# EasyEDA Pro project Hardware.epro, schematic Schematic1
Board Name: Board1; Create Date: 2025-01-02; Page Name: P1; Project Name: Taiwan; Schematic Name: Schematic1; Update Date: 2025-01-04; Company: EasyEDA.com; Page Size: A4; Version: V1.0
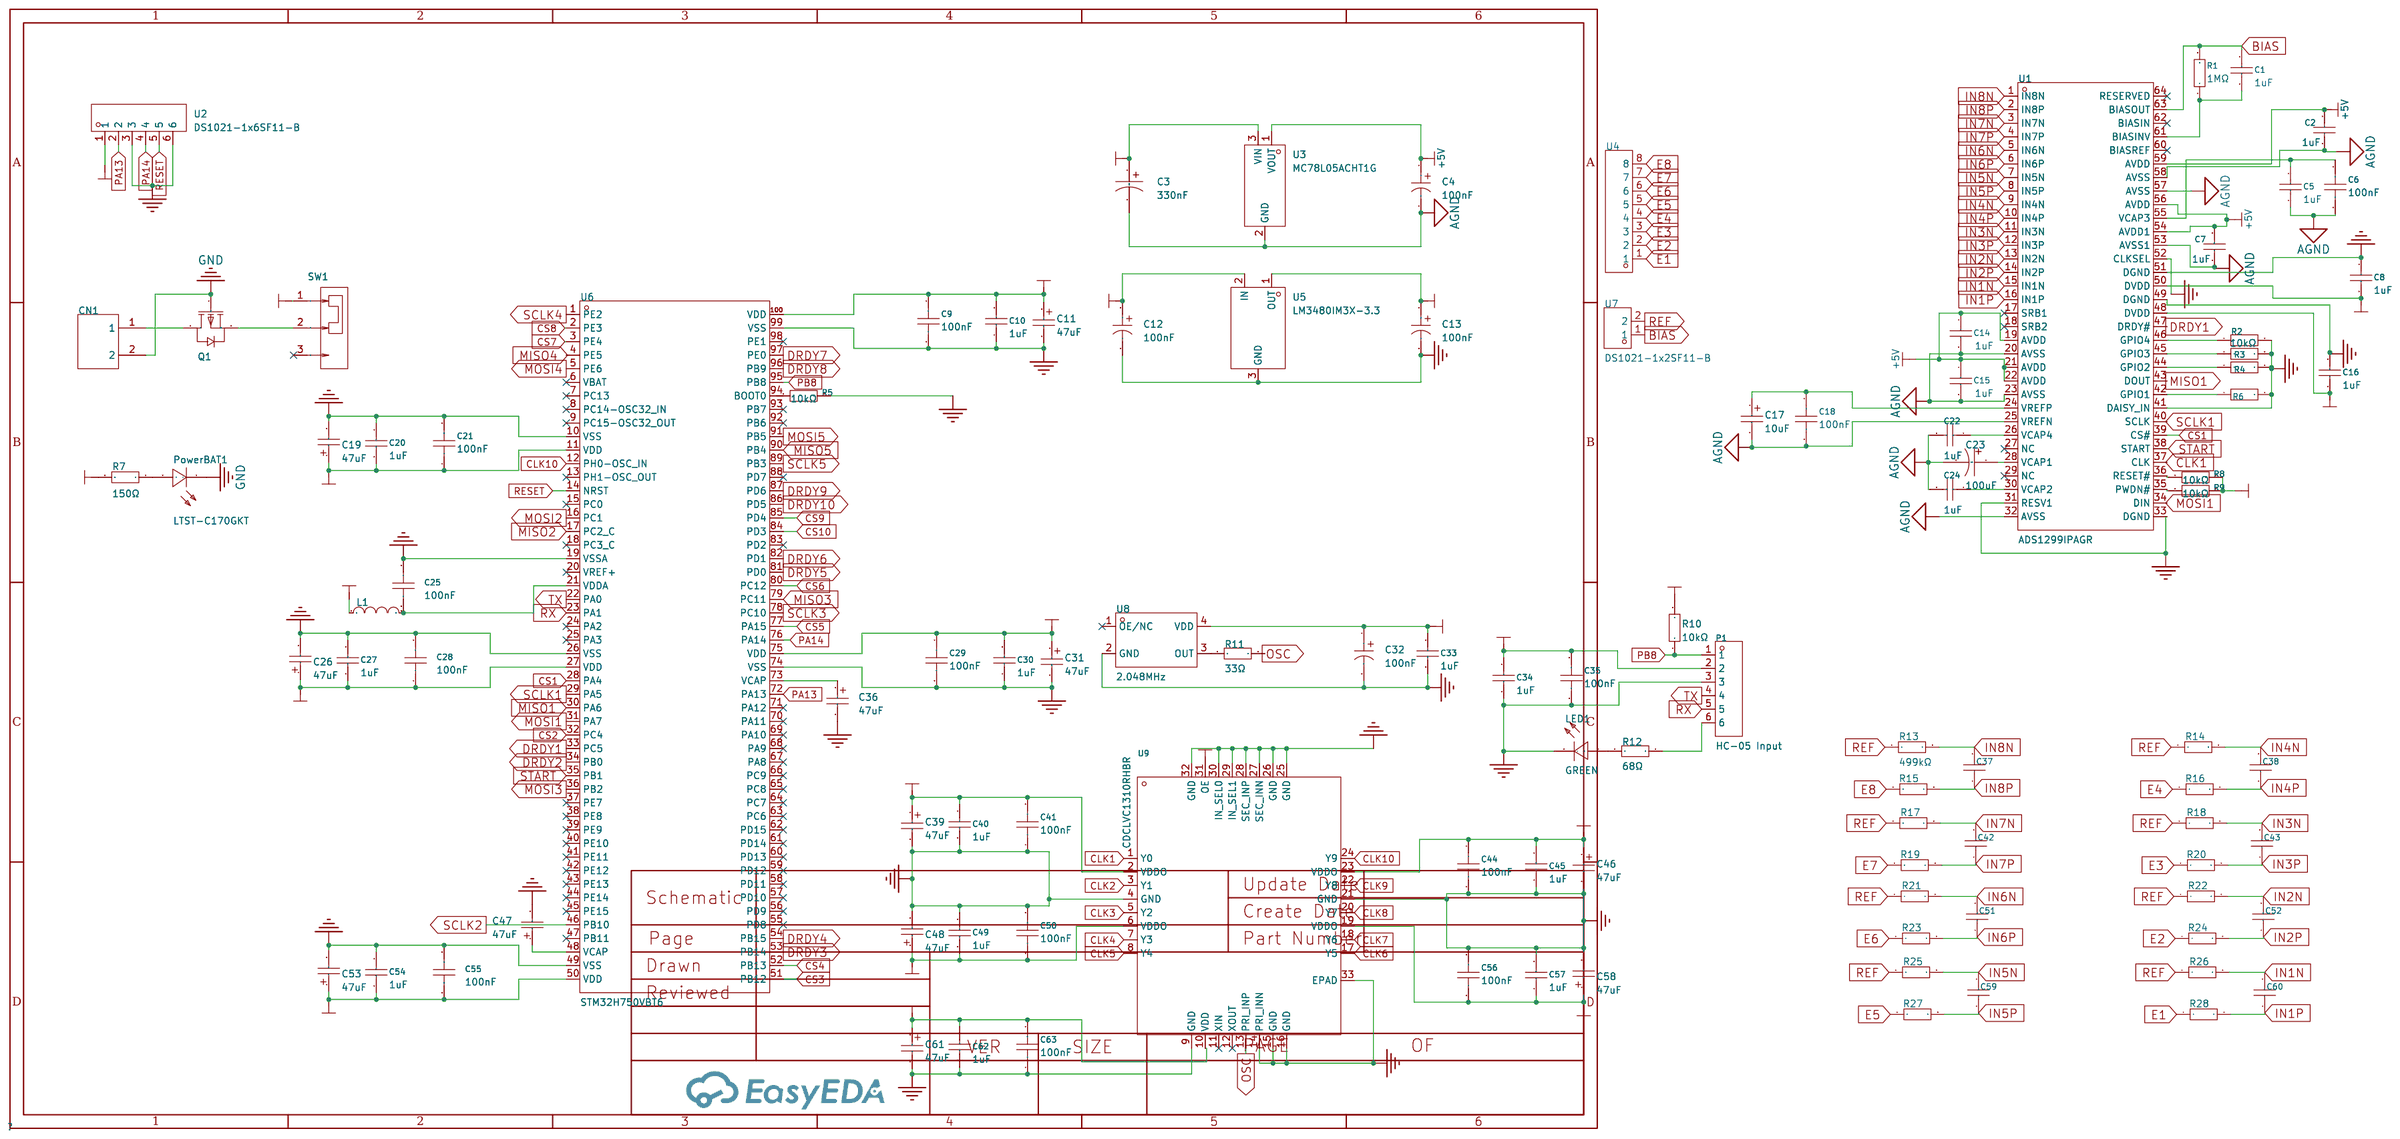
[diagram p0: schematic sheet]

## Parts
C1  1uF  [C0402]
C2  1uF  [C0402]
C3  330nF  [CAP-SMD_L3.2-W1.6]
C4  100nF  [CAP-SMD_L3.2-W1.6-RD]
C5  1uF  [C0402]
C6  100nF  [C0603]
C7  1uF  [C0402]
C8  1uF  [C0402]
C9  100nF  [C0603]
C10  1uF  [C0402]
C11  47uF  [CAP-SMD_L3.5-W2.8-R-RD]
C12  100nF  [CAP-SMD_L3.2-W1.6-RD]
C13  100nF  [CAP-SMD_L3.2-W1.6-RD]
C14  1uF  [C0402]
C15  1uF  [C0402]
C16  1uF  [C0402]
C17  10uF  [CASE-A_3216]
C18  100nF  [C0603]
C19  47uF  [CAP-SMD_L3.5-W2.8-R-RD]
C20  1uF  [C0402]
C21  100nF  [C0603]
C22  1uF  [C0402]
C23  100uF  [CAP-SMD_BD8.0-L8.3-W8.3-FD]
C24  1uF  [C0402]
C25  100nF  [C0603]
C26  47uF  [CAP-SMD_L3.5-W2.8-R-RD]
C27  1uF  [C0402]
C28  100nF  [C0603]
C29  100nF  [C0603]
C30  1uF  [C0402]
C31  47uF  [CAP-SMD_L3.5-W2.8-R-RD]
C32  100nF  [CAP-SMD_L3.2-W1.6-RD]
C33  1uF  [C0402]
C34  1uF  [C0402]
C35  100nF  [C0603]
C36  47uF  [CAP-SMD_L3.5-W2.8-R-RD]
C37  2.2nF  [C0603]
C38  2.2nF  [C0603]
C39  47uF  [CAP-SMD_L3.5-W2.8-R-RD]
C40  1uF  [C0402]
C41  100nF  [C0603]
C42  2.2nF  [C0603]
C43  2.2nF  [C0603]
C44  100nF  [C0603]
C45  1uF  [C0402]
C46  47uF  [CAP-SMD_L3.5-W2.8-R-RD]
C47  47uF  [CAP-SMD_L3.5-W2.8-R-RD]
C48  47uF  [CAP-SMD_L3.5-W2.8-R-RD]
C49  1uF  [C0402]
C50  100nF  [C0603]
C51  2.2nF  [C0603]
C52  2.2nF  [C0603]
C53  47uF  [CAP-SMD_L3.5-W2.8-R-RD]
C54  1uF  [C0402]
C55  100nF  [C0603]
C56  100nF  [C0603]
C57  1uF  [C0402]
C58  47uF  [CAP-SMD_L3.5-W2.8-R-RD]
C59  2.2nF  [C0603]
C60  2.2nF  [C0603]
C61  47uF  [CAP-SMD_L3.5-W2.8-R-RD]
C62  1uF  [C0402]
C63  100nF  [C0603]
CN1  B2B-PH-K-S(LF)(SN)  [CONN-TH_B2B-PH-K-S]
L1  BLM18KG601SN1D  [L0603]
LED1  GREEN  [LED0805-RD_GREEN]
P1  HC-05 Input  [HDR-TH_6P-P2.54-V-F]
PowerBAT1  LTST-C170GKT  [LED0805-RD_GREEN]
Q1  FQP47P06  [TO-220F-3_L10.2-W4.9-P2.54-L]
R1  1MΩ  [R0402]
R2  10kΩ  [R0402]
R3  10kΩ  [R0402]
R4  10kΩ  [R0402]
R5  10kΩ  [R0805]
R6  10kΩ  [R0402]
R7  150Ω  [R0402]
R8  10kΩ  [R0805]
R9  10kΩ  [R0805]
R10  10kΩ  [R0603]
R11  33Ω  [R0402]
R12  68Ω  [R0603]
R13  499kΩ  [R0603]
R14  499kΩ  [R0603]
R15  499kΩ  [R0603]
R16  499kΩ  [R0603]
R17  499kΩ  [R0603]
R18  499kΩ  [R0603]
R19  499kΩ  [R0603]
R20  499kΩ  [R0603]
R21  499kΩ  [R0603]
R22  499kΩ  [R0603]
R23  499kΩ  [R0603]
R24  499kΩ  [R0603]
R25  499kΩ  [R0603]
R26  499kΩ  [R0603]
R27  499kΩ  [R0603]
R28  499kΩ  [R0603]
SW1  SS-12D10-G050  [SW-TH_SS-12D10-G050]
U1  ADS1299IPAGR  [TQFP-64_L10.0-W10.0-P0.50-LS12.0-TL]
U2  DS1021-1x6SF11-B  [CONN-TH_DS1021-1X6SF11-B]
U3  MC78L05ACHT1G  [SOT-89-3_L4.5-W2.5-P1.50-LS4.2-BR]
U4  HB-PH3-25418PB2GOP  [HDR-TH_8P-P2.54-V-M]
U5  LM3480IM3X-3.3  [SOT-23-3_L2.9-W1.3-P1.90-LS2.4-BR]
U6  STM32H750VBT6  [LQFP-100_L14.0-W14.0-P0.50-LS16.0-BL]
U7  DS1021-1x2SF11-B  [HDR-TH_2P-P2.54-V-M]
U8  2.048MHz  [OSC-SMD_4P-L3.2-W2.5-BL-1]
U9  CDCLVC1310RHBR  [QFN-32_L5.0-W5.0-P0.50-TL-EP3.4]

## Library data of the parts
C1 C2 C5 C7 C8 C10 C14-C16 C20 C22 C24 C27 C30 C33 C34 C40 C45 C49 C54 C57 C62 = CL05A105KO5NNNC: Capacitance: Tolerance:±10% Tolerance:±10% Voltage Rated: Temperature Coefficient:; LCSC Part Name: 1uF ±10% 16V; Supplier Part: C29266; Manufacturer: SAMSUNG(三星); Supplier Footprint: 0402; Datasheet: https://atta.szlcsc.com/upload/public/pdf/source/20160218/1457707763339.pdf; Supplier: LCSC; Tolerance: ±10%
C3 = CA45A-A-35V-0.33UF-K: Capacitance:330nF Tolerance:±10% Tolerance:±10% Rated Voltage: Operating Temperature:-55℃~+125℃ Operating Temperature:-55℃~+125℃; LCSC Part Name: 330nF ±10% 35V; Supplier Part: C2976917; Manufacturer: CEC(振华新云); Supplier Footprint: SMD,1.6x3.2mm; JLCPCB Part Class: Extended Part; Datasheet: https://atta.szlcsc.com/upload/public/pdf/source/20220222/C2C5F368BEBB90E653B4407F98E5644A.pdf; Supplier: LCSC; Tolerance: ±10%; Operating Temperature: -55℃~+125℃
C4 C12 C13 C32 = CA45A-A-35V-0.1UF-K: Capacitance:100nF Tolerance:±10% Tolerance:±10% Rated Voltage: Operating Temperature:-55℃~+125℃ Operating Temperature:-55℃~+125℃; LCSC Part Name: 100nF ±10% 35V; Supplier Part: C2976899; Manufacturer: CEC(振华新云); Supplier Footprint: SMD,1.6x3.2mm; JLCPCB Part Class: Extended Part; Datasheet: https://atta.szlcsc.com/upload/public/pdf/source/20220222/C2C5F368BEBB90E653B4407F98E5644A.pdf; Supplier: LCSC; Tolerance: ±10%; Operating Temperature: -55℃~+125℃
C6 C9 C18 C21 C25 C28 C29 C35 C41 C44 C50 C55 C56 C63 = CC0603KRX7R9BB104: Capacitance: Tolerance:±10% Tolerance:±10% Voltage Rated: Temperature Coefficient:; LCSC Part Name: 100nF ±10% 50V; Supplier Part: C14663; Manufacturer: YAGEO(国巨); Supplier Footprint: 0603; JLCPCB Part Class: Basic Part; Datasheet: https://atta.szlcsc.com/upload/public/pdf/source/20180910/C282072_33301C7F631E79921B82A8DAC6BCC5B3.pdf; Supplier: LCSC; Tolerance: ±10%
C11 C19 C26 C31 C36 C39 C46-C48 C53 C58 C61 = CA45-B010K476T: Capacitance: Tolerance:±10% Tolerance:±10% Rated Voltage: Equivalent Series Resistance(ESR):1Ω@100kHz Operating Temperature:-55℃~+125℃ Operating Temperature:-55℃~+125℃; LCSC Part Name: 47uF ±10% 10V; Supplier Part: C123253; Manufacturer: 湘怡中元/湘江; Supplier Footprint: CASE-B-3528; JLCPCB Part Class: Extended Part; Datasheet: https://atta.szlcsc.com/upload/public/pdf/source/20191009/C435293_78A410F3D73489DBEAC46056C4262F7A.pdf; Supplier: LCSC; Tolerance: ±10%; Equivalent Series Resistance(ESR): 1Ω@100kHz; Operating Temperature: -55℃~+125℃
C17 = T491A106K016AT: Capacitance: Tolerance:±10% Tolerance:±10% Rated Voltage: Equivalent Series Resistance(ESR):3Ω@100kHz Operating Temperature:-55℃~+125℃ Operating Temperature:-55℃~+125℃; LCSC Part Name: 10uF ±10% 16V; Supplier Part: C110055; Manufacturer: KEMET(基美); Supplier Footprint: CASE-A-3216-18(mm); JLCPCB Part Class: Extended Part; Datasheet: https://atta.szlcsc.com/upload/public/pdf/source/20190402/C118128_17DC26F5D7668F0165447CB640F1E367.pdf; Supplier: LCSC; Tolerance: ±10%; Equivalent Series Resistance(ESR): 3Ω@100kHz; Operating Temperature: -55℃~+125℃
C23 = CK1H101M-CRF10: Capacitance: Tolerance:±20% Tolerance:±20% Rated Voltage: Ripple Current:- Equivalent Series Resistance(ESR):- φD: L: Lifetime @ Temp:2000hrs@105℃ Operating Temperature:-40℃~+105℃ Operating Temperature:-40℃~+105℃; LCSC Part Name: 100uF ±20% 50V; Supplier Part: C129420; Manufacturer: ST(先科); Supplier Footprint: SMD,D8xL10.5mm; Datasheet: https://atta.szlcsc.com/upload/public/pdf/source/20180511/C191812_AFB6060B7C8A92684C0DBB73273612B6.pdf; Supplier: LCSC; Tolerance: ±20%; Lifetime @ Temp: 2000hrs@105℃; Operating Temperature: -40℃~+105℃
C37 C38 C42 C43 C51 C52 C59 C60 = CC0603JRNPO9BN222: Capacitance: Tolerance:±5% Tolerance:±5% Voltage Rated: Temperature Coefficient:; LCSC Part Name: 2.2nF ±5% 50V; Supplier Part: C107043; Manufacturer: YAGEO(国巨); Supplier Footprint: 0603; JLCPCB Part Class: Extended Part; Datasheet: https://atta.szlcsc.com/upload/public/pdf/source/20170914/C128857_1505359892143968080.pdf; Supplier: LCSC; Tolerance: ±5%
CN1 = B2B-PH-K-S(LF)(SN): Pins Structure:1x2P Pitch:2mm Mounting Style:Direct Insert Reference Series:PH Number of Pins:2P Number of Rows:1 Number of PINs Per Row:2 Row Spacing:- Current Rating (Max):2A Contact Material:Brass Contact Plating:Tin Operating Temperature Range:-25℃~+8; LCSC Part Name: 1x2P 间距:2mm 直插 系列:PH; Supplier Part: C131337; Manufacturer: JST; Supplier Footprint: 插件,P=2mm; JLCPCB Part Class: Extended Part; Datasheet: https://atta.szlcsc.com/upload/public/pdf/source/20171026/C131342_15089839687311058815.pdf; Supplier: LCSC; Pins Structure: 1x2P; Pitch: 2mm; Mounting Style: Direct Insert; Reference Series: PH; Number of Pins: 2P; Number of Rows: 1; Number of PINs Per Row: 2; Current Rating (Max): 2A; Contact Material: Brass; Contact Plating: Tin; Operating Temperature Range: -25℃~+85℃; Rated Voltage (Max): 100V; Plastic Material: PA66; Flame Retardant Rating: UL94V-0; Supplementary Features: K-leg punch; Colour: White; Z-Height of the Board: 6mm; X-Length of Bottom Edge on Board (Spacing Line): 5.9mm; Y-Width of Bottom Edge on Board: 4.5mm
L1 = BLM18KG601SN1D: Impedance @ Frequency:600Ω@100MHz Tolerance:±25% Tolerance:±25% DC Resistance:150mΩ Current Rating:1.3A Circuits:1; LCSC Part Name: 单路 0603磁珠 阻抗600Ω@100MHz; Supplier Part: C85833; Manufacturer: muRata(村田); Supplier Footprint: 0603; JLCPCB Part Class: Extended Part; Datasheet: https://atta.szlcsc.com/upload/public/pdf/source/20180329/C160981_FD3C2D2622A377E203B89F4AA32B0741.pdf; Supplier: LCSC; Impedance @ Frequency: 600Ω@100MHz; Tolerance: ±25%; DC Resistance: 150mΩ; Current Rating: 1.3A; Circuits: 1
LED1 PowerBAT1 = LTST-C170GKT: Emitted Color:Green-yellow Forward Voltage (VF):2.1V Forward Voltage (VF):2.1V Power Dissipation:100mW Forward Current:20mA Dominant Wavelength:569nm Dominant Wavelength:569nm Peak Wavelength:565nm Diode Configuration:- Lens Color:无色透明透镜 Color Temperature; LCSC Part Name: 普绿/黄绿; Supplier Part: C125090; Manufacturer: LITEON(光宝); Supplier Footprint: 0805; JLCPCB Part Class: Extended Part; Datasheet: https://atta.szlcsc.com/upload/public/pdf/source/20180326/C125090_EBB69FE12E2FDEBBD69344A68ADD0880.pdf; Supplier: LCSC; Emitted Color: Green-yellow; Forward Voltage (VF): 2.1V; Power Dissipation: 100mW; Forward Current: 20mA; Dominant Wavelength: 569nm; Peak Wavelength: 565nm; Lens Color: 无色透明透镜; Luminous Intensity: 6mcd; Viewing Angle: 130°; Operating Temperature: -55℃~+85℃
P1 = 2.54-1*6P母: Holes Structure:1x6P Pitch:2.54mm Row Spacing:- Mounting Type:Straight Number of Rows:Plugin Number of Holes:6P Insulation Height:- Contact Material:- Contact Plating:-; LCSC Part Name: 间距:2.54mm 1x6P 直插; Supplier Part: C40877; Manufacturer: BOOMELE(博穆精密); Supplier Footprint: 插件,P=2.54mm; Datasheet: https://atta.szlcsc.com/upload/public/pdf/source/20210301/C2718488_F4427B881E42CAA8DDB0B1C12B3A522C.pdf; Supplier: LCSC; Holes Structure: 1x6P; Pitch: 2.54mm; Mounting Type: Straight; Number of Rows: Plugin; Number of Holes: 6P
Q1 = FQP47P06: Type:1个PChannel Drain Source Voltage (Vdss): Continuous Drain Current (Id): Power Dissipation (Pd): Drain Source On Resistance (RDS(on)@Vgs,Id):26mΩ@10V,23.5A Gate Threshold Voltage (Vgs(th)@Id): Total Gate Charge (Qg@Vgs):110nC@10V Input Capacitance (Cis; LCSC Part Name: 1个P沟道 耐压:60V 电流:47A; Supplier Part: C462765; Manufacturer: onsemi(安森美); Supplier Footprint: TO-220F-3; Datasheet: https://atta.szlcsc.com/upload/public/pdf/source/20221020/0214B1BC3D3CD69C1E14A9085F94831E.pdf; Supplier: LCSC; Type: 1个PChannel; Drain Source On Resistance (RDS(on)@Vgs,Id): 26mΩ@10V,23.5A; Total Gate Charge (Qg@Vgs): 110nC@10V; Input Capacitance (Ciss@Vds): 3.6nF@25V; Operating Temperature: -55℃~+175℃@(Tj)
R1 = 0402WGF1004TCE: Type:Thick Film Resistors Resistance:1MΩ Tolerance:±1% Tolerance:±1% Power(Watts): Overload Voltage (Max): Temperature Coefficient:±100ppm/℃ Temperature Coefficient:±100ppm/℃ Operating Temperature Range:-55℃~+155℃ Operating Temperature Range:-55℃~+155℃; LCSC Part Name: 1MΩ ±1% 62.5mW 厚膜电阻; Supplier Part: C26083; Manufacturer: UNI-ROYAL(厚声); Supplier Footprint: 0402; JLCPCB Part Class: Basic Part; Datasheet: https://atta.szlcsc.com/upload/public/pdf/source/20200306/C422600_1E6D84923E4A46A82E41ADD87F860B5C.pdf; Supplier: LCSC; Type: Thick Film Resistors; Tolerance: ±1%; Temperature Coefficient: ±100ppm/℃; Operating Temperature Range: -55℃~+155℃
R2-R4 R6 = TR0402D10K0Q1025Z: Type:Thin Film Resistor Resistance: Tolerance:±0.5% Tolerance:±0.5% Power(Watts): Overload Voltage (Max): Temperature Coefficient:±25ppm/℃ Temperature Coefficient:±25ppm/℃ Operating Temperature Range:-55℃~+155℃ Operating Temperature Range:-55℃~+155℃; LCSC Part Name: 薄膜电阻 10kΩ ±0.5% 63mW; Supplier Part: C149898; Manufacturer: EVER OHMS(天二科技); Supplier Footprint: 0402; Datasheet: https://atta.szlcsc.com/upload/public/pdf/source/20190527/C149900_32B1354086E9F6A772108AB7B2B7A514.pdf; Supplier: LCSC; Type: Thin Film Resistor; Tolerance: ±0.5%; Temperature Coefficient: ±25ppm/℃; Operating Temperature Range: -55℃~+155℃
R5 R8 R9 = QR0805J10K0P05Z: Type:Thick Film Resistors Resistance: Tolerance:±5% Tolerance:±5% Power(Watts): Overload Voltage (Max): Temperature Coefficient:±100ppm/℃ Temperature Coefficient:±100ppm/℃ Operating Temperature Range:-55℃~+155℃ Operating Temperature Range:-55℃~+155℃; LCSC Part Name: 厚膜电阻 10kΩ ±5% 125mW; Supplier Part: C149881; Manufacturer: EVER OHMS(天二科技); Supplier Footprint: 0805; JLCPCB Part Class: Extended Part; Datasheet: https://atta.szlcsc.com/upload/public/pdf/source/20190816/C191725_FB5BDDD87CE7DE7F0F741FE894220CBC.pdf; Supplier: LCSC; Type: Thick Film Resistors; Tolerance: ±5%; Temperature Coefficient: ±100ppm/℃; Operating Temperature Range: -55℃~+155℃
R7 = 0402WGF1500TCE: Type:Thick Film Resistors Resistance: Tolerance:±1% Tolerance:±1% Power(Watts): Overload Voltage (Max): Temperature Coefficient:±100ppm/℃ Temperature Coefficient:±100ppm/℃ Operating Temperature Range:-55℃~+155℃ Operating Temperature Range:-55℃~+155℃; LCSC Part Name: 150Ω ±1% 62.5mW 厚膜电阻; Supplier Part: C25082; Manufacturer: UNI-ROYAL(厚声); Supplier Footprint: 0402; JLCPCB Part Class: Extended Part; Datasheet: https://atta.szlcsc.com/upload/public/pdf/source/20200306/C422600_1E6D84923E4A46A82E41ADD87F860B5C.pdf; Supplier: LCSC; Type: Thick Film Resistors; Tolerance: ±1%; Temperature Coefficient: ±100ppm/℃; Operating Temperature Range: -55℃~+155℃
R10 = CR-03FA7---10K: Type:Thick Film Resistors Resistance: Tolerance:±1% Tolerance:±1% Power(Watts): Overload Voltage (Max): Operating Temperature Range:-55℃~+155℃ Operating Temperature Range:-55℃~+155℃; LCSC Part Name: 厚膜电阻 10kΩ ±1% 100mW; Supplier Part: C285206; Manufacturer: Viking(光颉); Supplier Footprint: 0603; JLCPCB Part Class: Extended Part; Datasheet: https://atta.szlcsc.com/upload/public/pdf/source/20200107/C465489_CF6A3EB1EF1274672E8D2C2ED68CFF51.pdf; Supplier: LCSC; Type: Thick Film Resistors; Tolerance: ±1%; Operating Temperature Range: -55℃~+155℃
R11 = RTT02330JTH: Type:Thick Film Resistors Resistance: Tolerance:±5% Tolerance:±5% Power(Watts): Overload Voltage (Max): Temperature Coefficient:±100ppm/℃ Temperature Coefficient:±100ppm/℃ Operating Temperature Range:-55℃~+155℃ Operating Temperature Range:-55℃~+155℃; LCSC Part Name: 厚膜电阻 33Ω ±5% 62.5mW; Supplier Part: C102978; Manufacturer: RALEC(旺诠); Supplier Footprint: 0402; Datasheet: https://atta.szlcsc.com/upload/public/pdf/source/20191219/C158410_884373A5B7E1BC76BF57BC45A946C093.pdf; Supplier: LCSC; Type: Thick Film Resistors; Tolerance: ±5%; Temperature Coefficient: ±100ppm/℃; Operating Temperature Range: -55℃~+155℃
R12 = RC0603FR-0768RL: Type:Thick Film Resistors Resistance: Tolerance:±1% Tolerance:±1% Power(Watts): Overload Voltage (Max): Temperature Coefficient:±100ppm/℃ Temperature Coefficient:±100ppm/℃ Operating Temperature Range:-55℃~+155℃ Operating Temperature Range:-55℃~+155℃; LCSC Part Name: 厚膜电阻 68Ω ±1% 100mW; Supplier Part: C126362; Manufacturer: YAGEO(国巨); Supplier Footprint: 0603; JLCPCB Part Class: Extended Part; Datasheet: https://atta.szlcsc.com/upload/public/pdf/source/20180821/C275644_0D56F95EFF785E7D9A1FEF436B37DA78.pdf; Supplier: LCSC; Type: Thick Film Resistors; Tolerance: ±1%; Temperature Coefficient: ±100ppm/℃; Operating Temperature Range: -55℃~+155℃
R13-R28 = RC0603FR-07499KL: Type:Thick Film Resistors Resistance: Tolerance:±1% Tolerance:±1% Power(Watts): Overload Voltage (Max): Temperature Coefficient:±100ppm/℃ Temperature Coefficient:±100ppm/℃ Operating Temperature Range:-55℃~+155℃ Operating Temperature Range:-55℃~+155℃; LCSC Part Name: 厚膜电阻 499kΩ ±1% 100mW; Supplier Part: C131054; Manufacturer: YAGEO(国巨); Supplier Footprint: 0603; JLCPCB Part Class: Extended Part; Datasheet: https://atta.szlcsc.com/upload/public/pdf/source/20180821/C275644_0D56F95EFF785E7D9A1FEF436B37DA78.pdf; Supplier: LCSC; Type: Thick Film Resistors; Tolerance: ±1%; Temperature Coefficient: ±100ppm/℃; Operating Temperature Range: -55℃~+155℃
SW1 = SS-12D10-G050: Circuit:SPDT Actuator Style:Rectangular columnar Pin Style:PCPin Switch Length:12.7mm Switch Width:6.8mm Switch Height:11.4mm Mounting Style:Straight Actuator Color:Black Current Rating (DC):3A Voltage Rating (DC):24V Current Rating (AC):- Voltage Rating; LCSC Part Name: 柄长5mm 直插两档 滑动开关; Supplier Part: C2848933; Manufacturer: G-Switch(品赞); Supplier Footprint: 插件; JLCPCB Part Class: Extended Part; Datasheet: https://atta.szlcsc.com/upload/public/pdf/source/20220706/9966F8B8B46280D285B978EDB9B49EE5.pdf; Supplier: LCSC; Circuit: SPDT; Actuator Style: Rectangular columnar; Pin Style: PCPin; Switch Length: 12.7mm; Switch Width: 6.8mm; Switch Height: 11.4mm; Mounting Style: Straight; Actuator Color: Black; Current Rating (DC): 3A; Voltage Rating (DC): 24V; Mechanical Life: 1万次; Operating Temperature: -25℃~+70℃
U1 = ADS1299IPAGR: Supply Voltage:5V；1.8V~3.6V Supply Voltage:5V；1.8V~3.6V; LCSC Part Name: ADS1299-x 低噪声、4/6/8通道、24bit 、同时采样模数转换器，用于EEG和生物电bit 测量; Supplier Part: C476817; Manufacturer: TI(德州仪器); Supplier Footprint: TQFP-64(10x10); JLCPCB Part Class: Extended Part; Datasheet: https://www.ti.com/cn/lit/gpn/ads1299; Supplier: LCSC; Supply Voltage: 5V；1.8V~3.6V
U2 = DS1021-1x6SF11-B: Pin Structure:1x6P Pitch:2.54mm Mounting Type:Direct Insert Number of Rows:Single Row Number of Pins:6P; LCSC Part Name: 1x6P 间距:2.54mm 直插; Supplier Part: C7430362; Manufacturer: CONNFLY; Supplier Footprint: 插件,P=2.54mm; JLCPCB Part Class: Extended Part; Datasheet: https://atta.szlcsc.com/upload/public/pdf/source/20230721/045F128FE19DC325F71FA0C1C07679E3.pdf; Supplier: LCSC; Pin Structure: 1x6P; Pitch: 2.54mm; Mounting Type: Direct Insert; Number of Rows: Single Row; Number of Pins: 6P
U3 = MC78L05ACHT1G: Output Type:Fixed Maximum Input Voltage:30V Output Voltage:5V Output Voltage:5V Output Current:100mA Power Supply Rejection Ratio (PSRR):49dB@(120Hz) standby current:6mA Feature:ESD Protection；Short-Circuit  Protection；Thermal Protection(TSD)；Under-voltag; Supplier Part: C904222; Manufacturer: onsemi(安森美); Supplier Footprint: SOT-89-3; Datasheet: https://atta.szlcsc.com/upload/public/pdf/source/20210719/C903152_B90E42F1E3F8E53767481E91112C0A3A.pdf; Supplier: LCSC; Output Type: Fixed; Maximum Input Voltage: 30V; Output Voltage: 5V; Output Current: 100mA; Power Supply Rejection Ratio (PSRR): 49dB@(120Hz); standby current: 6mA; Feature: ESD Protection；Short-Circuit  Protection；Thermal Protection(TSD)；Under-voltage Lockout；Overcurrent Protection(OCP)；With ability; Operating Temperature: 0℃~+125℃; Output Polarity: Positive electrode; Number of Outputs: 1
U4 = HB-PH3-25418PB2GOP: Pin Structure:1x8P Pitch:2.54mm Row Spacing:2.54mm Circluar Pins/Square Pins:Policy Mounting Type:Direct Insert Number of Rows:Single Row Number of Pins:8P Current Rating (Max):3A Voltage Rating (Max):250V Length of Mating Pin:6mm Insulation Height:2.54mm; LCSC Part Name: 间距:2.54mm 1x8P 直插 方针; Supplier Part: C6332201; Manufacturer: HANBO(汉博); Supplier Footprint: 插件,P=2.54mm; JLCPCB Part Class: Extended Part; Datasheet: https://atta.szlcsc.com/upload/public/pdf/source/20230803/F72D259687963761DF1B552F3BB84A31.pdf; Supplier: LCSC; Pin Structure: 1x8P; Pitch: 2.54mm; Row Spacing: 2.54mm; Circluar Pins/Square Pins: Policy; Mounting Type: Direct Insert; Number of Rows: Single Row; Number of Pins: 8P; Current Rating (Max): 3A; Voltage Rating (Max): 250V; Length of Mating Pin: 6mm; Insulation Height: 2.54mm; Length of End Connection Pin: 3mm; Contact Material: Brass; Contact Plating: Gold; Operating Temperature Range: -40℃~+105℃; Soldering Temperature(Max): 260℃; Color: Black
U5 = LM3480IM3X-3.3: Output Type:Fixed Maximum Input Voltage:30V Output Voltage:3.3V Output Voltage:3.3V Output Current:100mA Dropout Voltage:1.2V@(100mA) standby current:2mA Feature:ESD Protection；Overcurrent Protection(OCP)；With ability Operating Temperature:-40℃~+125℃ Oper; LCSC Part Name: 100mA、30V 低压降稳压器; Supplier Part: C962953; Manufacturer: TI(德州仪器); Supplier Footprint: SOT-23; JLCPCB Part Class: Extended Part; Datasheet: https://www.ti.com/cn/lit/gpn/lm3480; Supplier: LCSC; Output Type: Fixed; Maximum Input Voltage: 30V; Output Voltage: 3.3V; Output Current: 100mA; Dropout Voltage: 1.2V@(100mA); standby current: 2mA; Feature: ESD Protection；Overcurrent Protection(OCP)；With ability; Operating Temperature: -40℃~+125℃; Output Polarity: Positive electrode; Number of Outputs: 1
U6 = STM32H750VBT6: CPU Core:- Program Storage Size:128KB RAM Size:1MB GPIO Ports Number:82 Operating Voltage Range:1.62V~3.6V Operating Voltage Range:1.62V~3.6V CPU Maximum Speed:480MHz Program Memory Type:FLASH Operating Temperature Range:-40℃~+85℃ Operating Temperature Ra; LCSC Part Name: 带DSP和DP-FPU的高性能ARM Cortex-M7 MCU，具有128 KB Flash、1 MB RAM、480 MHz CPU、一级缓存、外部存储器接口、JPEG编解码器、硬件加密和大量外设; Supplier Part: C404010; Manufacturer: ST(意法半导体); Supplier Footprint: LQFP-100(14x14); JLCPCB Part Class: Extended Part; Datasheet: https://atta.szlcsc.com/upload/public/pdf/source/20231008/912982D4F3BD3DF1AA7D0A7EE6EF5B6B.pdf; Supplier: LCSC; Program Storage Size: 128KB; RAM Size: 1MB; GPIO Ports Number: 82; Operating Voltage Range: 1.62V~3.6V; CPU Maximum Speed: 480MHz; Program Memory Type: FLASH; Operating Temperature Range: -40℃~+85℃; ADC (Bit): 16bit; DAC (Bit): 12bit; Universal Serial Bus: Yes; Peripheral/Function: DMA；LCD/LED Driver; Watchdog: Yes; Infrared Data Association: Yes; Low-Voltage Detect: Yes; LCD Module: Yes; Secure Digital Input and Output: Yes; Direct Memory Access: Yes; Internal Oscillator: Yes
U7 = DS1021-1x2SF11-B: Pin Structure:1x2P Pitch:2.54mm Mounting Type:Straight Number of Rows:Plugin Number of Pins:2P; LCSC Part Name: 1x2P 间距:2.54mm 直插; Supplier Part: C7430358; Manufacturer: CONNFLY; Supplier Footprint: 插件,P=2.54mm; JLCPCB Part Class: Extended Part; Datasheet: https://atta.szlcsc.com/upload/public/pdf/source/20230721/045F128FE19DC325F71FA0C1C07679E3.pdf; Supplier: LCSC; Pin Structure: 1x2P; Pitch: 2.54mm; Mounting Type: Straight; Number of Rows: Plugin; Number of Pins: 2P
U8 = OT32252.048MJBA4SL: Frequency:2.048MHz Normal temperature Frequency Tolerance:±10ppm Normal temperature Frequency Tolerance:±10ppm Output Type:CMOS Supply Voltage:1.8V~3.3V Supply Voltage:1.8V~3.3V Frequency Stability(Full temperature range):±20ppm Frequency Stability(Full t; LCSC Part Name: 2.048MHz ±10ppm 1.8V~3.3V YSO110TR; Supplier Part: C2831386; Manufacturer: YXC(扬兴晶振); Supplier Footprint: SMD3225-4P; JLCPCB Part Class: Extended Part; Datasheet: https://atta.szlcsc.com/upload/public/pdf/source/20240329/730BB30F784D239B033636DF5970F6CE.pdf; Supplier: LCSC; Normal temperature Frequency Tolerance: ±10ppm; Output Type: CMOS; Supply Voltage: 1.8V~3.3V; Frequency Stability(Full temperature range): ±20ppm; Operating Temperature: -40℃~+85℃
U9 = CDCLVC1310RHBR: Supplier Part: C182328; Manufacturer: TI(德州仪器); Supplier Footprint: QFN-32-EP(5x5); JLCPCB Part Class: Extended Part; Datasheet: https://www.ti.com/cn/lit/gpn/cdclvc1310; Supplier: LCSC

## Nets
+3.3V: C8.2 C9.1 C10.2 C11.1 C13.1 C16.2 C19.1 C20.2 C21.1 C26.1 C27.2 C28.1 C29.1 C30.2 C31.1 C32.1 C33.1 C34.1 C35.2 C39.1 C40.1 C41.2 C44.1 C45.2 C46.1 C48.1 C49.2 C50.1 C53.1 C54.2 C55.1 C56.2 C57.1 C58.1 C61.1 C62.1 C63.2 L1.1 P1.2 R8.1 R9.1 R10.2 U1.48(DVDD) U1.50(DVDD) U2.1 U5.1(OUT) U6.11(VDD) U6.27(VDD) U6.50(VDD) U6.75(VDD) U6.100(VDD) U8.4(VDD) U9.2(VDDO) U9.6(VDDO) U9.10(VDD) U9.19(VDDO) U9.23(VDDO) U9.31(OE)
+5V: C2.2 C4.1 C7.2 C14.1 C15.1 U1.19(AVDD) U1.21(AVDD) U1.22(AVDD) U1.54(AVDD1) U1.56(AVDD) U1.59(AVDD) U3.1(VOUT)
AGND: C2.1 C3.2 C4.2 C5.2 C6.2 C7.1 C14.2 C15.2 C17.2 C18.2 C22.2 C23.2 C24.2 U1.20(AVSS) U1.23(AVSS) U1.25(VREFN) U1.32(AVSS) U1.53(AVSS1) U1.57(AVSS) U1.58(AVSS) U3.2(GND)
DGND: C8.1 C9.2 C10.1 C11.2 C12.2 C13.2 C16.1 C19.2 C20.1 C21.2 C25.1 C26.2 C27.1 C28.2 C29.2 C30.1 C31.2 C32.2 C33.2 C34.2 C35.1 C36.2 C39.2 C40.2 C41.1 C44.2 C45.1 C46.2 C47.2 C48.2 C49.1 C50.2 C53.2 C54.1 C55.2 C56.1 C57.2 C58.2 C61.2 C62.2 C63.1 LED1.1(-) P1.3 R2.2 R3.2 R4.2 R5.1 R6.2 U1.31(RESV1) U1.33(DGND) U1.41(DAISY_IN) U1.49(DGND) U1.51(DGND) U1.52(CLKSEL) U2.3 U2.6 U5.3(GND) U6.10(VSS) U6.19(VSSA) U6.26(VSS) U6.49(VSS) U6.74(VSS) U6.99(VSS) U8.2(GND) U9.4(GND) U9.9(GND) U9.14(PRI_INN) U9.15(GND) U9.16(GND) U9.21(GND) U9.25(GND) U9.26(GND) U9.27(SEC_INN) U9.28(SEC_INP) U9.29(IN_SEL1) U9.30(IN_SEL0) U9.32(GND) U9.33(EPAD)
GND: CN1.2 PowerBAT1.1(-) Q1.1(G)
BAT: C3.1 C12.1 R7.2 SW1.1 U3.3(VIN) U5.2(IN)
BIAS: C1.1 R1.2 U1.63(BIASOUT) U7.1
CLK1: U1.37(CLK) U9.1(Y0)
CLK2: U9.3(Y1)
CLK3: U9.5(Y2)
CLK4: U9.7(Y3)
CLK5: U9.8(Y4)
CLK6: U9.17(Y5)
CLK7: U9.18(Y6)
CLK8: U9.20(Y7)
CLK9: U9.22(Y8)
CLK10: U6.12(PH0-OSC_IN) U9.24(Y9)
CS1: U1.39(CS#) U6.28(PA4)
CS2: U6.32(PC4)
CS3: U6.51(PB12)
CS4: U6.52(PB13)
CS5: U6.77(PA15)
CS6: U6.80(PC12)
CS7: U6.3(PE4)
CS8: U6.2(PE3)
CS9: U6.85(PD4)
CS10: U6.84(PD3)
DRDY1: U1.47(DRDY#) U6.33(PC5)
DRDY2: U6.34(PB0)
DRDY3: U6.53(PB14)
DRDY4: U6.54(PB15)
DRDY5: U6.81(PD0)
DRDY6: U6.82(PD1)
DRDY7: U6.97(PE0)
DRDY8: U6.96(PB9)
DRDY9: U6.87(PD6)
DRDY10: U6.86(PD5)
E1: R28.1 U4.1
E2: R24.1 U4.2
E3: R20.1 U4.3
E4: R16.1 U4.4
E5: R27.1 U4.5
E6: R23.1 U4.6
E7: R19.1 U4.7
E8: R15.1 U4.8
IN1N: C60.2 R26.2 U1.15(IN1N)
IN1P: C60.1 R28.2 U1.16(IN1P)
IN2N: C52.2 R22.2 U1.13(IN2N)
IN2P: C52.1 R24.2 U1.14(IN2P)
IN3N: C43.2 R18.2 U1.11(IN3N)
IN3P: C43.1 R20.2 U1.12(IN3P)
IN4N: C38.2 R14.2 U1.9(IN4N)
IN4P: C38.1 R16.2 U1.10(IN4P)
IN5N: C59.2 R25.2 U1.7(IN5N)
IN5P: C59.1 R27.2 U1.8(IN5P)
IN6N: C51.2 R21.2 U1.5(IN6N)
IN6P: C51.1 R23.2 U1.6(IN6P)
IN7N: C42.2 R17.2 U1.3(IN7N)
IN7P: C42.1 R19.2 U1.4(IN7P)
IN8N: C37.2 R13.2 U1.1(IN8N)
IN8P: C37.1 R15.2 U1.2(IN8P)
MISO1: U1.43(DOUT) U6.30(PA6)
MISO2: U6.17(PC2_C)
MISO3: U6.79(PC11)
MISO4: U6.4(PE5)
MISO5: U6.90(PB4)
MOSI1: U1.34(DIN) U6.31(PA7)
MOSI2: U6.16(PC1)
MOSI3: U6.36(PB2)
MOSI4: U6.5(PE6)
MOSI5: U6.91(PB5)
OSC: R11.2 U9.13(PRI_INP)
PA13: U2.2 U6.72(PA13)
PA14: U2.4 U6.76(PA14)
PB8: P1.1 R10.1 U6.95(PB8)
REF: R13.1 R14.1 R17.1 R18.1 R21.1 R22.1 R25.1 R26.1 U7.2
RESET: U2.5 U6.14(NRST)
RX: P1.5 U6.23(PA1)
SCLK1: U1.40(SCLK) U6.29(PA5)
SCLK2: U6.46(PB10)
SCLK3: U6.78(PC10)
SCLK4: U6.1(PE2)
SCLK5: U6.89(PB3)
START: U1.38(START) U6.35(PB1)
TX: P1.4 U6.22(PA0)
$1N10676: Q1.3(S) SW1.2
$1N10712: CN1.1 Q1.2(D)
Net-(C1-2): C1.2 R1.1 U1.61(BIASINV)
Net-(C5-1): C5.1 C6.1 U1.55(VCAP3)
Net-(C17-1): C17.1 C18.1 U1.24(VREFP)
Net-(C22-1): C22.1 U1.26(VCAP4)
Net-(C23-1): C23.1 U1.28(VCAP1)
Net-(C24-1): C24.1 U1.30(VCAP2)
Net-(C25-2): C25.2 L1.2 U6.21(VDDA)
Net-(C36-1): C36.1 U6.73(VCAP)
Net-(C47-1): C47.1 U6.48(VCAP)
Net-(LED1-2): LED1.2(+) R12.2
Net-(P1-6): P1.6 R12.1
Net-(PowerBAT1-2): PowerBAT1.2(+) R7.1
Net-(R2-1): R2.1 U1.46(GPIO4)
Net-(R3-1): R3.1 U1.45(GPIO3)
Net-(R4-1): R4.1 U1.44(GPIO2)
Net-(R5-2): R5.2 U6.94(BOOT0)
Net-(R6-1): R6.1 U1.42(GPIO1)
Net-(R8-2): R8.2 U1.36(RESET#)
Net-(R9-2): R9.2 U1.35(PWDN#)
Net-(R11-1): R11.1 U8.3(OUT)

Not connected (* = marked no-connect by the designer): SW1 3*; U1 17(SRB1)* 18(SRB2)* 27(NC)* 29(NC)* 60(BIASREF)* 62(BIASIN)* 64(RESERVED)*; U6 6(VBAT)* 7(PC13)* 8(PC14-OSC32_IN)* 9(PC15-OSC32_OUT)* 13(PH1-OSC_OUT)* 15(PC0)* 18(PC3_C)* 20(VREF+)* 24(PA2)* 25(PA3)* 37(PE7)* 38(PE8)* 39(PE9)* 40(PE10)* 41(PE11)* 42(PE12)* 43(PE13)* 44(PE14)* 45(PE15)* 47(PB11)* 55(PD8)* 56(PD9)* 57(PD10)* 58(PD11)* 59(PD12)* 60(PD13)* 61(PD14)* 62(PD15)* 63(PC6)* 64(PC7)* 65(PC8)* 66(PC9)* 67(PA8)* 68(PA9)* 69(PA10)* 70(PA11)* 71(PA12)* 83(PD2)* 88(PD7)* 92(PB6)* 93(PB7)* 98(PE1)*; U8 1(OE/NC)*; U9 11(XIN)* 12(XOUT)*
